# EAGLE design oven-controller-v3 (EAGLE 6.5.0)
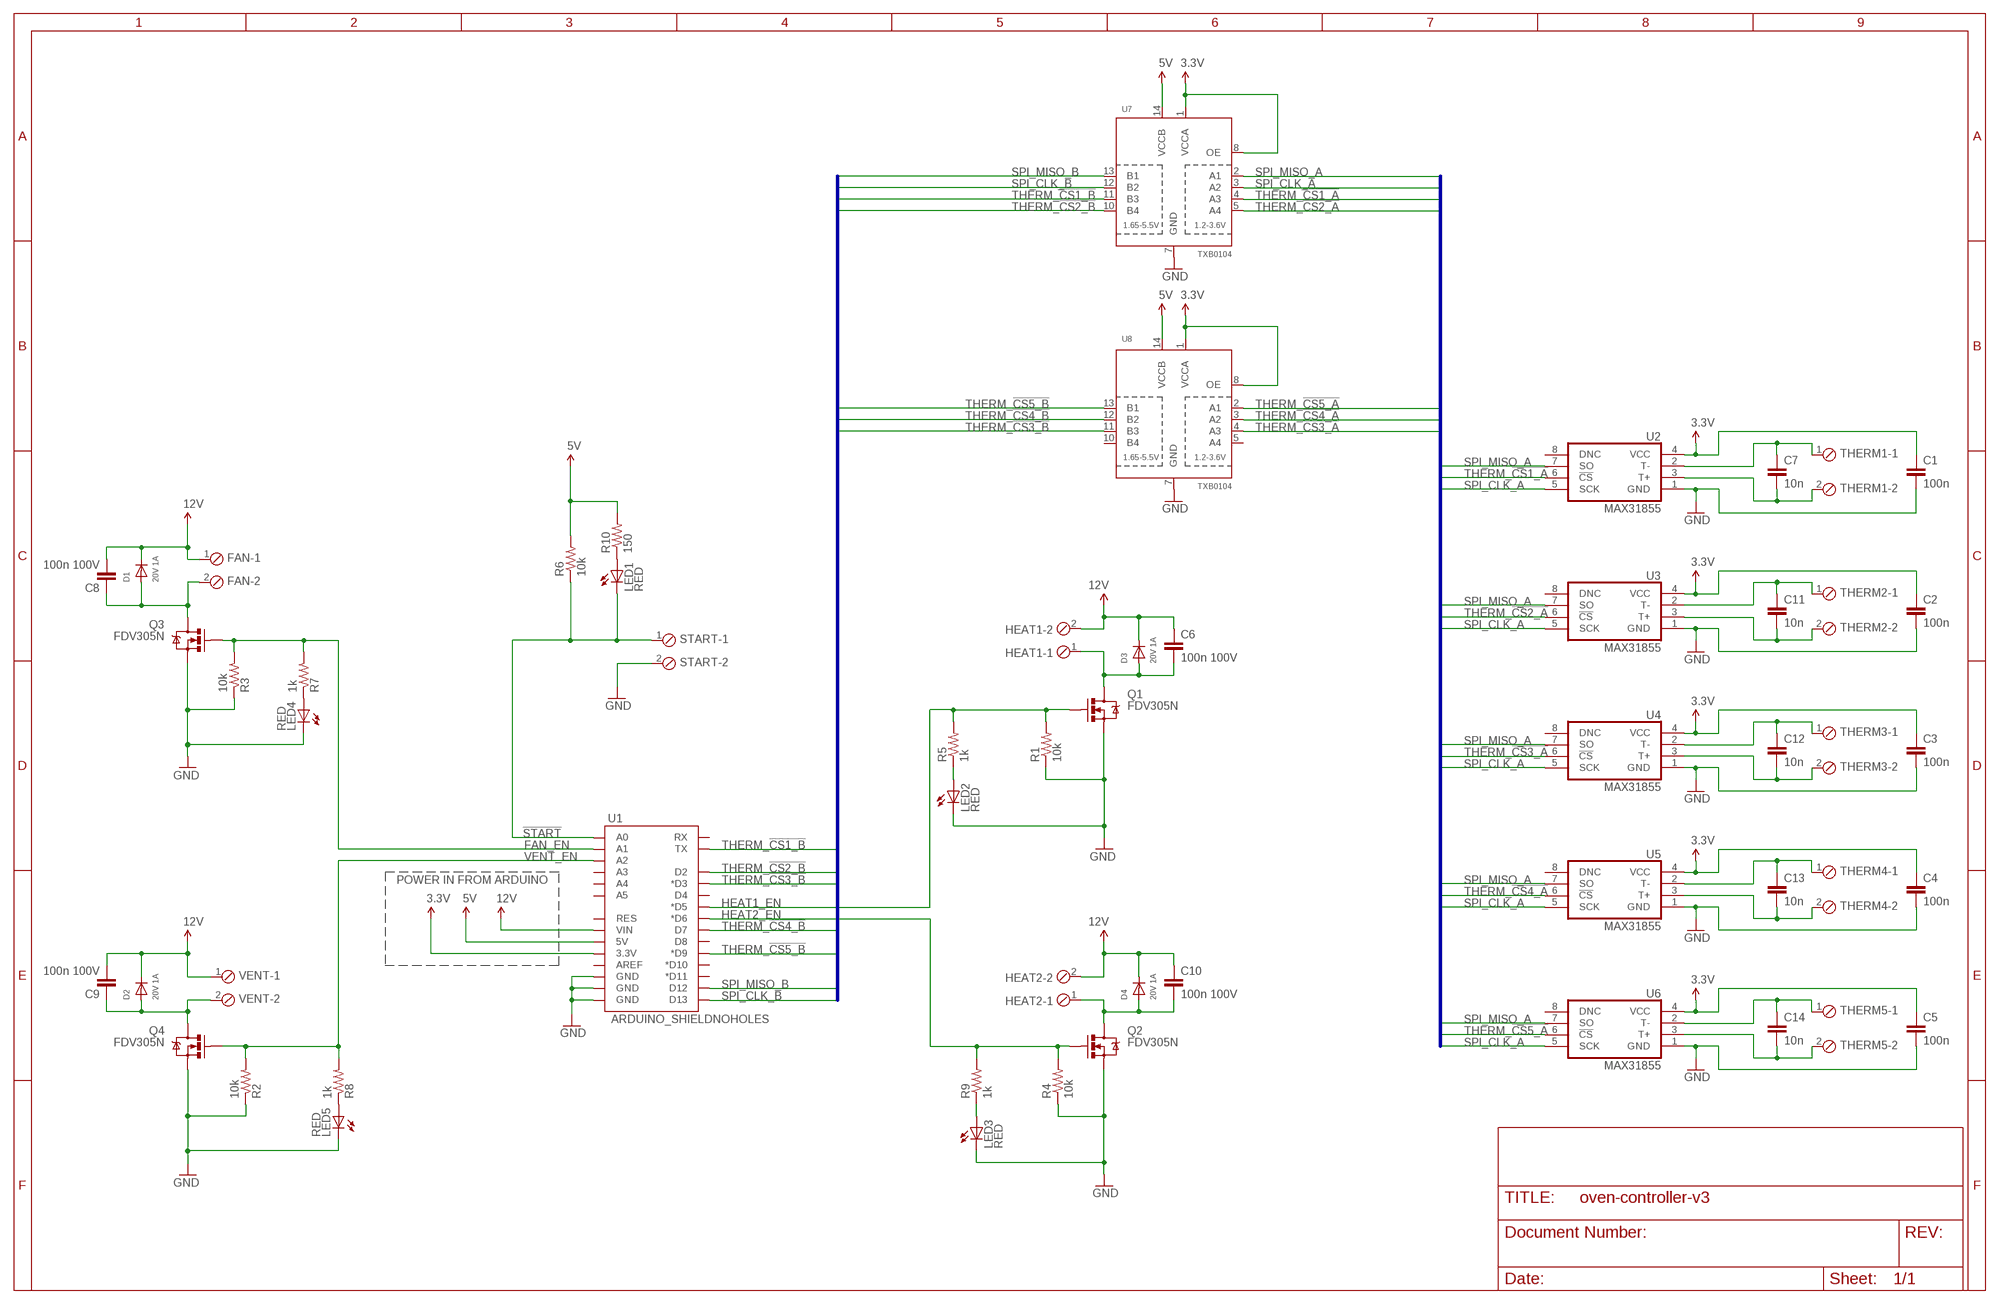
[diagram p0: schematic, sheet 1]

## Parts
C1  100n  C-EUC0603K  [C0603K]
C2  100n  C-EUC0603K  [C0603K]
C3  100n  C-EUC0603K  [C0603K]
C4  100n  C-EUC0603K  [C0603K]
C5  100n  C-EUC0603K  [C0603K]
C6  100n 100V  C-EUC0603K  [C0603K]
C7  10n  C-EUC0603K  [C0603K]
C8  100n 100V  C-EUC0603K  [C0603K]
C9  100n 100V  C-EUC0603K  [C0603K]
C10  100n 100V  C-EUC0603K  [C0603K]
C11  10n  C-EUC0603K  [C0603K]
C12  10n  C-EUC0603K  [C0603K]
C13  10n  C-EUC0603K  [C0603K]
C14  10n  C-EUC0603K  [C0603K]
D1  20V 1A  DIODE-DO214AC-SMA  [DO-214AC-SMA]
D2  20V 1A  DIODE-DO214AC-SMA  [DO-214AC-SMA]
D3  20V 1A  DIODE-DO214AC-SMA  [DO-214AC-SMA]
D4  20V 1A  DIODE-DO214AC-SMA  [DO-214AC-SMA]
FAN  MPT2  [2POL254]
HEAT1  MPT2  [2POL254]
HEAT2  MPT2  [2POL254]
LED1  RED  LED0603  [LED-0603]
LED2  RED  LED0603  [LED-0603]
LED3  RED  LED0603  [LED-0603]
LED4  RED  LED0603  [LED-0603]
LED5  RED  LED0603  [LED-0603]
Q1  FDV305N  MOSFET-NCHANNELSMD  [SOT23-3]
Q2  FDV305N  MOSFET-NCHANNELSMD  [SOT23-3]
Q3  FDV305N  MOSFET-NCHANNELSMD  [SOT23-3]
Q4  FDV305N  MOSFET-NCHANNELSMD  [SOT23-3]
R1  10k  R-US_0603-C-NOSILK  [0603-C-NOSILK]
R2  10k  R-US_0603-C-NOSILK  [0603-C-NOSILK]
R3  10k  R-US_0603-C-NOSILK  [0603-C-NOSILK]
R4  10k  R-US_0603-C-NOSILK  [0603-C-NOSILK]
R5  1k  R-US_0603-C-NOSILK  [0603-C-NOSILK]
R6  10k  R-US_0603-C-NOSILK  [0603-C-NOSILK]
R7  1k  R-US_0603-C-NOSILK  [0603-C-NOSILK]
R8  1k  R-US_0603-C-NOSILK  [0603-C-NOSILK]
R9  1k  R-US_0603-C-NOSILK  [0603-C-NOSILK]
R10  150  R-US_0603-C-NOSILK  [0603-C-NOSILK]
START  MPT2  [2POL254]
THERM1  MPT2  [2POL254]
THERM2  MPT2  [2POL254]
THERM3  MPT2  [2POL254]
THERM4  MPT2  [2POL254]
THERM5  MPT2  [2POL254]
U1  ARDUINO_SHIELDNOHOLES  [DUEMILANOVE_SHIELD_NOHOLES]
U2  MAX31855  IC_MAX31855-SO-8  [SO-8]
U3  MAX31855  IC_MAX31855-SO-8  [SO-8]
U4  MAX31855  IC_MAX31855-SO-8  [SO-8]
U5  MAX31855  IC_MAX31855-SO-8  [SO-8]
U6  MAX31855  IC_MAX31855-SO-8  [SO-8]
U7  TXB0104  TXB0104PWR  [TSSOP14]
U8  TXB0104  TXB0104PWR  [TSSOP14]
VENT  MPT2  [2POL254]

## Nets
3.3V: C1.1 C2.1 C3.1 C4.1 C5.1 U1.3.3V U2.4(VCC) U3.4(VCC) U4.4(VCC) U5.4(VCC) U6.4(VCC) U7.1(VCCA) U7.8(OE) U8.1(VCCA) U8.8(OE)
5V: R6.2 R10.2 U1.5V U7.14(VCCB) U8.14(VCCB)
12V: C6.1 C8.2 C9.2 C10.1 D1.C D2.C D3.C D4.C FAN.1 HEAT1.2 HEAT2.2 U1.VIN VENT.1
!START: LED1.C R6.1 START.1 U1.A0
FAN_EN: Q3.1(G) R3.2 R7.2 U1.A1
GND: C1.2 C2.2 C3.2 C4.2 C5.2 LED2.C LED3.C LED4.C LED5.C Q1.2(S) Q2.2(S) Q3.2(S) Q4.2(S) R1.1 R2.1 R3.1 R4.1 START.2 U1.GND@0(GND) U1.GND@1(GND) U1.GND@2(GND) U2.1(GND) U3.1(GND) U4.1(GND) U5.1(GND) U6.1(GND) U7.7(GND) U8.7(GND)
HDR3: C8.1 D1.A FAN.2 Q3.3(D)
HEAT1_EN: Q1.1(G) R1.2 R5.2 U1.D5(*D5)
HEAT2_EN: Q2.1(G) R4.2 R9.2 U1.D6(*D6)
N$1: LED1.A R10.1
N$2: C7.1 THERM1.1 U2.2(T-)
N$3: C9.1 D2.A Q4.3(D) VENT.2
N$4: C6.2 D3.A HEAT1.1 Q1.3(D)
N$5: C7.2 THERM1.2 U2.3(T+)
N$6: C13.1 THERM4.1 U5.2(T-)
N$7: LED2.A R5.1
N$8: C13.2 THERM4.2 U5.3(T+)
N$9: LED4.A R7.1
N$10: C12.1 THERM3.1 U4.2(T-)
N$12: C11.1 THERM2.1 U3.2(T-)
N$13: C11.2 THERM2.2 U3.3(T+)
N$15: C14.2 THERM5.2 U6.3(T+)
N$17: C14.1 THERM5.1 U6.2(T-)
N$18: LED3.A R9.1
N$19: LED5.A R8.1
N$20: C12.2 THERM3.2 U4.3(T+)
N$21: C10.2 D4.A HEAT2.1 Q2.3(D)
SPI_CLK_A: U2.5(SCK) U3.5(SCK) U4.5(SCK) U5.5(SCK) U6.5(SCK) U7.3(A2)
SPI_CLK_B: U1.D13 U7.12(B2)
SPI_MISO_A: U2.7(SO) U3.7(SO) U4.7(SO) U5.7(SO) U6.7(SO) U7.2(A1)
SPI_MISO_B: U1.D12 U7.13(B1)
THERM_!CS1_A: U2.6(!CS) U7.4(A3)
THERM_!CS1_B: U1.TX U7.11(B3)
THERM_!CS2_A: U3.6(!CS) U7.5(A4)
THERM_!CS2_B: U1.D2 U7.10(B4)
THERM_!CS3_A: U4.6(!CS) U8.4(A3)
THERM_!CS3_B: U1.D3(*D3) U8.11(B3)
THERM_!CS4_A: U5.6(!CS) U8.3(A2)
THERM_!CS4_B: U1.D7 U8.12(B2)
THERM_!CS5_A: U6.6(!CS) U8.2(A1)
THERM_!CS5_B: U1.D9(*D9) U8.13(B1)
VENT_EN: Q4.1(G) R2.2 R8.2 U1.A2
Unconnected: U1.A3 U1.A4 U1.A5 U1.AREF U1.D4 U1.D8 U1.D10(*D10) U1.D11(*D11) U1.RES U1.RX U2.8(DNC) U3.8(DNC) U4.8(DNC) U5.8(DNC) U6.8(DNC) U8.5(A4) U8.10(B4)

## Buses
THERM_!CS1_B,THERM_!CS2_B,THERM_!CS3_B,THERM_!CS4_B,THERM_!CS5_B,SPI_MISO_B,SPI_CLK_B
SPI_MISO_A,SPI_CLK_A,THERM_!CS1_A,THERM_!CS2_A,THERM_!CS3_A,THERM_!CS4_A,THERM_!CS5_A

## Notes on the sheet
- POWER IN FROM ARDUINO

## Library data of the parts
C1-C14 = rcl_custom:C-EU: CAPACITOR, European symbol
D1-D4 = wicker:DIODE-DO214AC-SMA
FAN HEAT1 HEAT2 START THERM1-THERM5 VENT = con-phoenix-254:MPT2: PHOENIX CONNECTOR; OC_FARNELL: unknown; OC_NEWARK: unknown
LED1-LED5 = SparkFun-LED:LED: LEDs Standard schematic elements and footprints for 5mm, 3mm, 1206, and 0603 sized LEDs. 5mm - Spark Fun Electronics SKU : COM-00529 (and others)
Q1-Q4 = SparkFun-DiscreteSemi:MOSFET-NCHANNEL: Generic NMOS footprint
R1-R10 = rcl_custom:R-US_: RESISTOR, American symbol
U1 = SparkFun-Boards:ARDUINO_SHIELD: Arduino shield footprint
U2-U6 = dp_devices:IC_MAX31855
U7 U8 = SparkFun-DigitalIC:TXB0104PWR: 4-Bit Bi-Directional Level Shifter 1.2V-3.6V (VCCA) to 1.65V-5.5V (VCCB) bi-directional level shifter with auto direction sensing. Max data rate - VCCA 1.8V: 20Mbps (50ns), VCCA 3.3V: 100Mbps (10ns) Digikey: 296-21929-1-ND (TSSOP) IC-11329

## Board
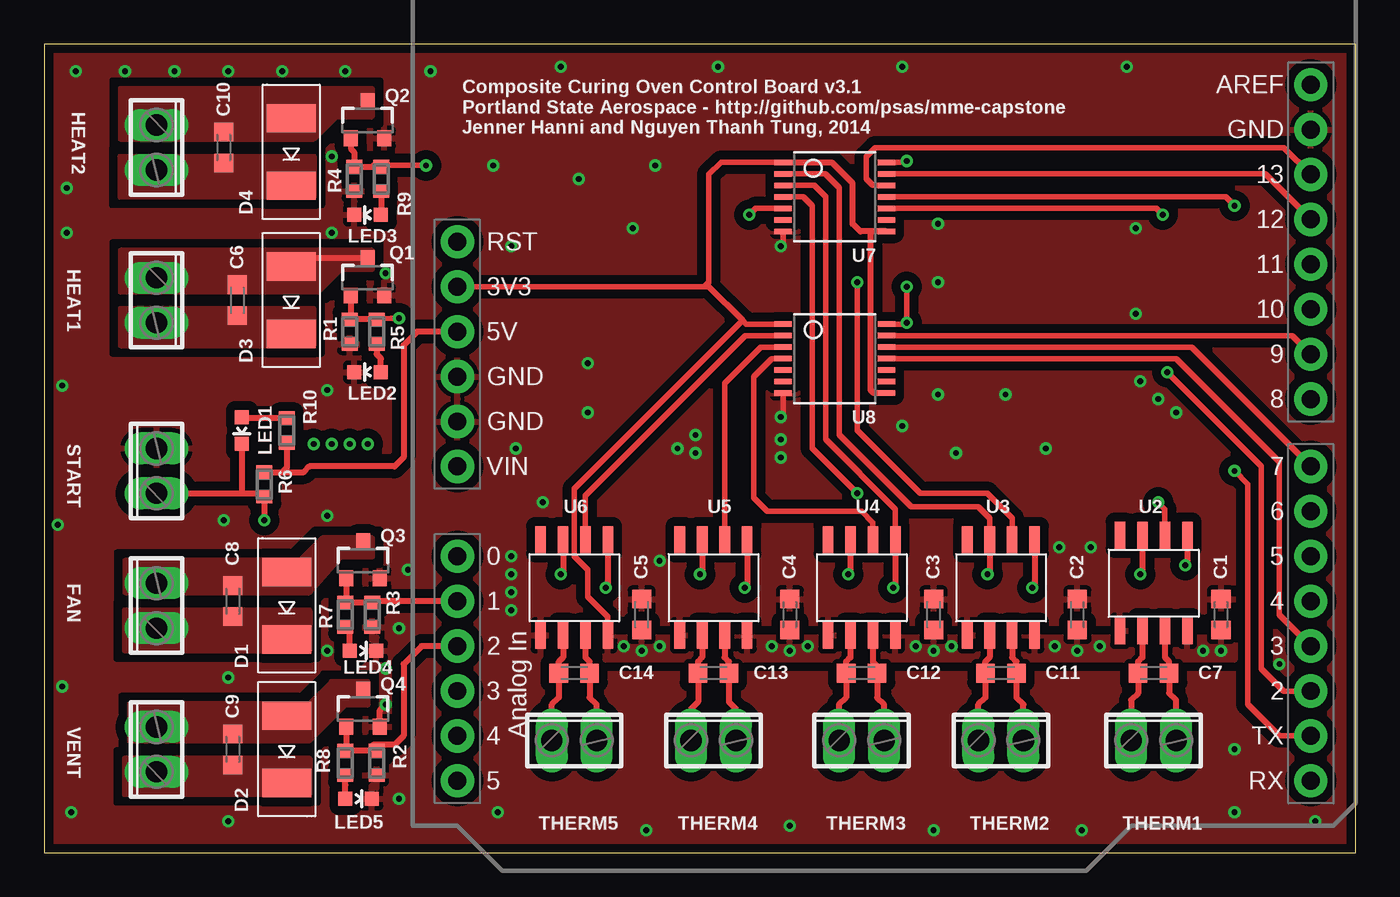
[diagram p1: board, top side]
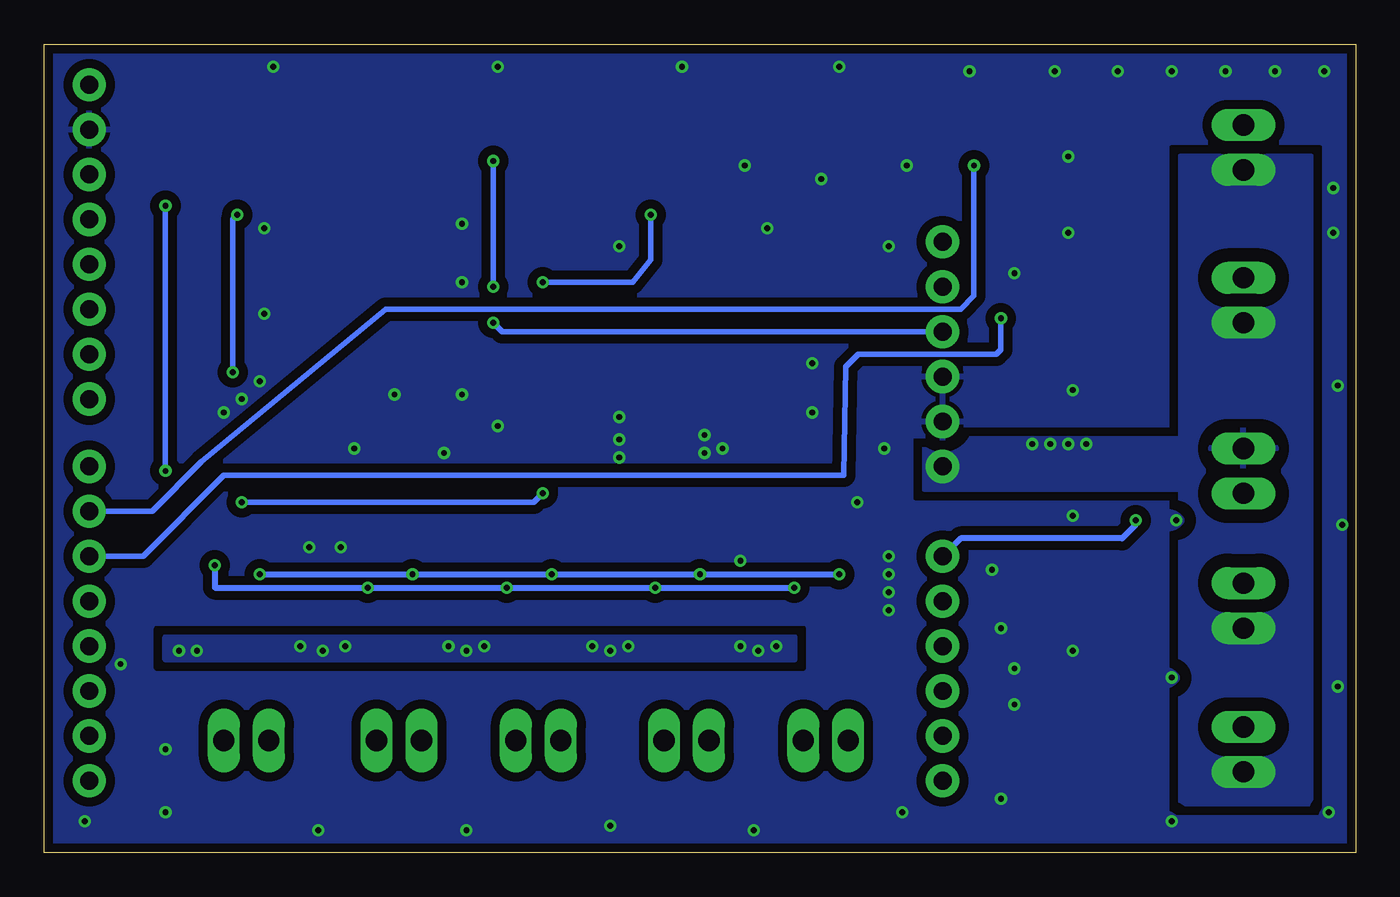
[diagram p2: board, bottom side, seen from below]

Size 74.17 x 45.72 mm. Coordinates in mm from the lower left corner, seen from the top.
Outline: 74.17,0 74.17,45.72 0,45.72 0,0 74.17,0
Copper layers (1*16): Top 0.0356mm / dielectric 1.5011mm / Bottom 0.0356mm
Design rules "LaenPCBOrder": minimum track width 6mil, minimum drill 13mil, track to track 6mil, track to pad 6mil, pad to pad 6mil, via to via 6mil, smd to smd 6mil, copper to edge 15mil, drill to drill 6mil, minimum pad ring 7mil, minimum via ring 7mil, stop-mask expansion 3mil, vias tented up to drill 0mil, thermal gap 10mil

### Footprints (pad centres in the part's own frame; a part is rotated, then mirrored left to right if it is on the bottom)
C0603K = smd 1.05 x 1.08: 1 -0.875,0; 2 0.875,0
DO-214AC-SMA = smd 1.6 x 2.794: A 1.905,0; C -1.905,0
2POL254 = drill 1.2 long: 1 -1.27,0; 2 1.27,0
LED-0603 = smd 0.8 x 0.8: A 0,-0.75; C 0,0.75
SOT23-3 = smd 0.8 x 0.9: 1 -0.95,-1; 2 0.95,-1; 3 0,1.1
0603-C-NOSILK = smd 0.75 x 0.9: 1 -0.7,0; 2 0.7,0
DUEMILANOVE_SHIELD_NOHOLES = drill 1.016 pad 1.88: 3.3V 50.8,26.67; 5V 50.8,29.21; A0 50.8,41.91; A1 50.8,44.45; A2 50.8,46.99; A3 50.8,49.53; A4 50.8,52.07; A5 50.8,54.61; AREF 2.54,15.24; D2 2.54,49.53; D3 2.54,46.99; D4 2.54,44.45; D5 2.54,41.91; D6 2.54,39.37; D7 2.54,36.83; D8 2.54,33.02; D9 2.54,30.48; D10 2.54,27.94; D11 2.54,25.4; D12 2.54,22.86; D13 2.54,20.32; GND@0 50.8,31.75; GND@1 50.8,34.29; GND@2 2.54,17.78; RES 50.8,24.13; RX 2.54,54.61; TX 2.54,52.07; VIN 50.8,36.83
SO-8 = smd 0.6 x 1.55: 1 -1.905,-2.69; 2 -0.635,-2.69; 3 0.635,-2.69; 4 1.905,-2.69; 5 1.905,2.71; 6 0.635,2.71; 7 -0.635,2.71; 8 -1.905,2.71
TSSOP14 = smd 0.305 x 0.991: 1 -1.95,-2.918; 2 -1.3,-2.918; 3 -0.65,-2.918; 4 0,-2.918; 5 0.65,-2.918; 6 1.3,-2.918; 7 1.95,-2.918; 8 1.95,2.918; 9 1.3,2.918; 10 0.65,2.918; 11 0,2.918; 12 -0.65,2.918; 13 -1.3,2.918; 14 -1.95,2.918

### Placement (x,y rotation side)
C1  66.55,13.46 90 top
C2  58.42,13.46 90 top
C3  50.29,13.46 90 top
C4  42.16,13.46 90 top
C5  33.78,13.46 90 top
C6  10.92,31.24 90 top
C7  62.74,10.16 0 top
C8  10.67,14.22 270 top
C9  10.67,5.84 270 top
C10  10.16,39.88 90 top
C11  54.1,10.16 0 top
C12  46.23,10.16 0 top
C13  37.85,10.16 0 top
C14  29.97,10.16 0 top
D1  13.72,13.97 90 top
D2  13.72,5.84 90 top
D3  13.97,31.24 90 top
D4  13.97,39.62 90 top
FAN  6.35,13.97 90 top
HEAT1  6.35,31.24 270 top
HEAT2  6.35,39.88 270 top
LED1  11.18,23.88 180 top
LED2  18.29,27.18 90 top
LED3  18.29,36.07 90 top
LED4  18.03,11.43 270 top
LED5  17.78,3.05 270 top
Q1  18.29,32.51 0 top
Q2  18.29,41.4 0 top
Q3  18.03,16.51 0 top
Q4  18.03,8.13 0 top
R1  17.27,29.46 90 top
R2  18.8,5.08 90 top
R3  18.54,13.46 90 top
R4  17.53,38.1 90 top
R5  18.8,29.46 90 top
R6  12.45,20.83 90 top
R7  17.02,13.46 90 top
R8  17.02,5.08 90 top
R9  19.05,38.1 90 top
R10  13.72,23.88 270 top
START  6.35,21.59 90 top
THERM1  62.74,6.35 0 top
THERM2  54.1,6.35 0 top
THERM3  46.23,6.35 0 top
THERM4  37.85,6.35 0 top
THERM5  29.97,6.35 0 top
U1  74.17,58.67 180 top
U2  62.74,15.24 0 top
U3  54.1,14.99 0 top
U4  46.23,14.99 0 top
U5  37.85,14.99 0 top
U6  29.97,14.99 0 top
U7  44.7,37.08 270 top
U8  44.7,27.94 270 top
VENT  6.35,5.84 90 top

### Tracks (layer width: path | path; a pad name or v marks a point on that pad's centre or on a via)
3.3V  (via drill 0.33)
  Top 0.305: U1.3.3V 37.34,32 | 37.34,32 37.59,32 39.5,30.1 | 39.5,30.1 39.71,29.89 U8.1 | U7.1 38.27,39.03 37.59,38.35 37.59,32.26 37.34,32 | U6.4 31.88,13.34 30.73,14.48 30.73,16 29.97,16.76 29.97,20.57 39.5,30.1
  Top 0.33: U7.8 46.74,35.13 | 46.74,35.13 46.15,35.13 45.72,35.56 45.72,37.85 44.53,39.03 U7.1 | U8.8 46.91,25.99 46.74,26.16 46.74,35.13
  other vias: 32.77,11.68 34.8,11.68 41.15,11.68 43.18,11.68 49.28,11.68 51.31,11.68 57.15,11.68 59.69,11.68 66.55,11.43 65.53,11.43 33.78,11.43 42.16,11.43 50.29,11.43 58.42,11.43
  pour Top (isolate 0.254, rank 2): 67.31,10.92 31.75,10.92 31.75,12.19 67.31,12.19
  pour Bottom: 31.75,12.19 31.75,10.92 67.31,10.92 67.31,12.19
5V  (via drill 0.33 pad 0.69)
  Top 0.305: U7.14 48.69,39.03 v48.77,39.12 | U8.14 48.69,29.89 v48.77,29.97 v48.77,32
  Top 0.33: R6.2 13.46,21.53 | 13.46,21.53 14.68,21.53 15,21.84 19.81,21.84 20.32,22.35 20.32,28.7 21.08,29.46 U1.5V | R10.2 13.72,21.78 13.46,21.53
  Bottom 0.305: U1.5V 48.26,29.46 v48.77,29.97 | v48.77,39.12 v48.77,32
12V  (via drill 0.33 pad 0.69)
  other vias: 15.24,23.11 16.26,23.11 17.27,23.11 18.29,23.11
  pour Bottom (isolate 0.762, no thermals): 2.54,39.37 9.91,39.37 9.91,23.37 24.38,23.37 24.38,20.57 9.91,20.57 9.91,2.79 2.54,2.79
  pour Top (no thermals): 4.32,39.37 15.24,39.37 15.24,37.08 4.32,37.08
  pour Top (no thermals): 15.24,28.7 15.24,30.73 4.32,30.73 4.32,28.7
  pour Top (no thermals): 4.57,13.72 14.99,13.72 14.99,11.43 4.57,11.43
  pour Top (no thermals): 4.57,5.33 14.99,5.33 14.99,3.3 4.57,3.3
!START  (via drill 0.33 pad 0.69)
  Top 0.33: v12.45,18.8 R6.1 12.25,20.32 11.18,20.32 | START.1 11.18,20.32 | LED1.C 11.18,20.32
  Bottom 0.33: v12.45,18.8 12.45,18.54 13.21,17.78 22.35,17.78 U1.A0
FAN_EN
  Top 0.33: Q3.1 17.08,14.35 R7.2 R3.2 18.6,14.22 U1.A1
GND  (via drill 0.33 pad 0.69)
  Top 0.305: U7.7 41.79,34.42 v41.66,34.29 | U8.7 41.79,24.77 v41.66,24.64
  Top 0.33: Q4.2 18.98,8.06 v19.3,8.38
  other vias: 26.42,16.76 26.42,15.75 26.42,14.73 26.42,13.72 25.4,38.86 48.51,44.45 57.4,17.27 59.18,17.27 16.26,35.05 16.26,39.37 19.3,32.77 20.07,3.05 16,11.43 10.41,9.91 10.16,18.8 16,19.05 16,26.16 10.41,1.78 34.8,16.51 26.42,34.29 1.78,44.2 4.57,44.2 7.37,44.2 10.41,44.2 13.46,44.2 17.02,44.2 21.84,44.2 29.21,44.45 61.21,44.45 1.27,37.59 1.27,35.05 1.02,26.42 0.76,18.54 1.02,9.4 1.52,2.29 25.65,2.29 34.04,1.27 42.16,1.52 50.29,1.27 58.67,1.27 67.31,5.84 67.31,2.29 71.88,1.78 69.85,10.67 20.07,12.7 19.3,10.41 20.57,16 38.1,44.45 41.66,23.37 41.66,22.35 36.83,23.62 35.81,22.86 36.83,22.61 48.51,24.13 50.55,25.91 51.56,22.61 54.36,25.91 56.64,22.86 61.98,26.67 62.99,25.65 64.01,24.89 61.72,30.48 61.72,35.31 50.55,35.56 50.55,32.26 30.73,24.89 30.73,27.69 28.19,19.81 26.67,22.86 34.54,38.86 30.23,38.1 33.27,35.31
  pour Bottom (isolate 0.508, rank 6): 0,0 74.17,0 74.17,45.72 0,45.72
  pour Top (isolate 0.508, rank 6): 0,0 74.17,0 74.17,45.72 0,45.72
HDR3
  pour Top (no thermals): 16.76,16.76 18.54,16.76 18.54,17.78 15.75,17.78 14.48,16.51 4.57,16.51 4.57,14.73 14.99,14.73
HEAT1_EN  (via drill 0.33 pad 0.69)
  Top 0.305: v20.07,30.23 19.62,30.23 R5.2
  Top 0.33: R5.2 R1.2 17.34,30.61 Q1.1
  Bottom 0.305: U1.D5 68.58,16.76 64.01,21.34 28.96,21.34 28.84,27.49 28.13,28.19 20.32,28.19 20.07,28.45 v20.07,30.23
HEAT2_EN  (via drill 0.33 pad 0.69)
  Top 0.305: v21.59,38.86 18.6,38.86 18.54,38.8
  Top 0.33: R9.2 18.54,38.8 R4.2 17.53,39.62 17.34,39.81 Q2.1
  Bottom 0.305: U1.D6 68.07,19.3 65.28,22.1 54.86,30.73 22.35,30.73 21.59,31.5 v21.59,38.86
N$1
  Top 0.33: R10.1 11.23,24.58 LED1.A
N$2
  Top 0.33: U2.2 62.1,11.05 61.86,10.81 C7.1 61.86,9.03 61.47,8.64 THERM1.1
N$3
  pour Top (no thermals): 14.99,6.35 17.02,8.38 18.29,8.38 18.29,9.65 16.26,9.65 14.99,8.38 4.83,8.38 4.83,6.35
N$4
  Top 0.33: Q1.3 13.99,33.61 D3.A
  pour Top (no thermals): 18.54,34.04 4.32,34.04 4.32,31.75 15.49,31.75 16.76,33.02 18.54,33.02
N$5
  Top 0.33: THERM1.2 64.01,8.64 63.61,9.03 C7.2 63.61,10.81 63.37,11.05 U2.3
N$6
  Top 0.33: THERM4.1 36.58,8.13 36.97,8.52 C13.1 36.97,10.81 37.21,11.05 U5.2
N$7
  Top 0.33: R5.1 18.8,28.19 19.05,27.94 19.04,27.93 LED2.A
N$8
  Top 0.33: U5.3 38.48,11.05 38.72,10.81 C13.2 38.72,8.52 39.12,8.13 THERM4.2
N$9
  Top 0.33: LED4.A 17.28,12.75 R7.1
N$10
  Top 0.33: U4.2 45.59,11.05 45.35,10.81 C12.1 45.35,8.78 44.96,8.38 THERM3.1
N$12
  Top 0.33: U3.2 53.47,11.05 53.23,10.81 C11.1 53.23,8.78 52.83,8.38 THERM2.1
N$13
  Top 0.33: U3.3 54.74,11.05 54.98,10.81 C11.2 54.98,8.78 55.37,8.38 THERM2.2
N$15
  Top 0.33: U6.3 30.61,11.05 30.85,10.81 C14.2 30.85,8.78 31.24,8.38 THERM5.2
N$17
  Top 0.33: U6.2 29.34,11.05 29.1,10.81 C14.1 29.1,8.78 28.7,8.38 THERM5.1
N$18
  Top 0.33: R9.1 LED3.A
N$19
  Top 0.33: LED5.A 17.03,3.82 17.02,4.06 R8.1
N$20
  Top 0.33: U4.3 46.86,10.79 47.1,10.55 C12.2 47.1,8.78 47.5,8.38 THERM3.2
N$21
  pour Top (no thermals): 18.54,43.18 4.32,43.18 4.32,40.39 15.24,40.39 16.51,41.66 18.54,41.66
SPI_CLK_A  (via drill 0.33 pad 0.69)
  Top 0.305: U7.3 43.55,37.73 44.2,37.08 44.2,23.37 48.13,19.43 U4.5
  Top 0.33: U6.5 31.88,14.86 v31.75,14.99 | U4.5 48.13,14.86 v48.01,14.99 | U5.5 39.75,14.86 v39.62,14.99 | U3.5 56.01,14.86 v55.88,14.99 | U2.5 64.64,16.38 v64.52,16.26
  Bottom 0.33: v64.52,16.26 64.52,14.99 v55.88,14.99 v48.01,14.99 v39.62,14.99 v31.75,14.99
SPI_CLK_B
  Top 0.305: U7.12 46.85,37.73 46.48,38.1 46.48,39.37 46.99,39.88 70.1,39.88 U1.D13
SPI_MISO_A  (via drill 0.33 pad 0.69)
  Top 0.305: U7.2 44.17,38.38 44.96,37.59 44.96,23.62 49.02,19.56 52.83,19.56 53.47,18.92 U3.7
  Top 0.33: U6.7 29.34,15.88 v29.21,15.75 | U4.7 45.59,15.88 v45.47,15.75 | U5.7 37.21,15.88 v37.08,15.75 | U3.7 53.47,15.88 v53.34,15.75 | U2.7 62.1,15.88 v61.98,15.75
  Bottom 0.33: v61.98,15.75 v53.34,15.75 v45.47,15.75 v37.08,15.75 v29.21,15.75
SPI_MISO_B
  Top 0.305: U7.13 69.06,38.38 U1.D12
THERM_!CS1_A  (via drill 0.33 pad 0.69)
  Top 0.305: U7.4 42.93,37.08 43.43,36.58 43.43,22.86 v45.97,20.32 | U2.6 63.37,19.43 v62.99,19.81
  Bottom 0.305: v62.99,19.81 46.48,19.81 v45.97,20.32
THERM_!CS1_B  (via drill 0.33 pad 0.69)
  Top 0.305: U7.11 66.8,37.08 v67.31,36.58 | U1.TX 69.85,6.6 68.07,8.38 68.07,20.83 v67.31,21.59
  Bottom 0.305: v67.31,21.59 v67.31,36.58 67.18,36.7
THERM_!CS2_A  (via drill 0.33 pad 0.69)
  Top 0.305: U7.5 40.24,36.43 v39.88,36.07 | U3.6 54.74,18.92 53.34,20.32 49.53,20.32 45.97,23.88 v45.97,32.26
  Bottom 0.305: v45.97,32.26 40.89,32.26 39.88,33.53 v39.88,36.07
THERM_!CS2_B  (via drill 0.33 pad 0.69)
  Top 0.305: U1.D2 70.1,9.14 68.83,10.41 68.83,21.84 v63.5,27.18 | U7.10 62.88,36.43 v63.25,36.07
  Bottom 0.305: v63.5,27.18 63.5,35.81 v63.25,36.07
THERM_!CS3_A
  Top 0.305: U8.4 41.15,27.94 40.13,26.92 40.13,20.07 40.89,19.3 46.23,19.3 46.86,18.67 U4.6
THERM_!CS3_B
  Top 0.305: U8.11 64.01,27.94 69.85,22.1 69.85,13.46 U1.D3
THERM_!CS4_A
  Top 0.305: U8.3 40.53,28.59 38.48,26.54 U5.6
THERM_!CS4_B
  Top 0.305: U8.12 64.88,28.59 U1.D7
THERM_!CS5_A
  Top 0.305: U8.2 39.65,29.24 30.61,20.19 U6.6
THERM_!CS5_B
  Top 0.305: U8.13 70.58,29.24 U1.D9
VENT_EN
  Top 0.33: U1.A2 21.34,11.68 20.32,10.67 20.32,6.6 19.81,6.1 18.6,6.1 R2.2 R8.2 17.08,6.22 Q4.1

### Text on the board
tNames: Composite Curing Oven Control Board v3.1 / Portland State Aerospace - http://github.com/psas/mme-capstone / Jenner Hanni and Nguyen Thanh Tung, 2014